# EAGLE design Noduino-Falcon (EAGLE 6.6.0)
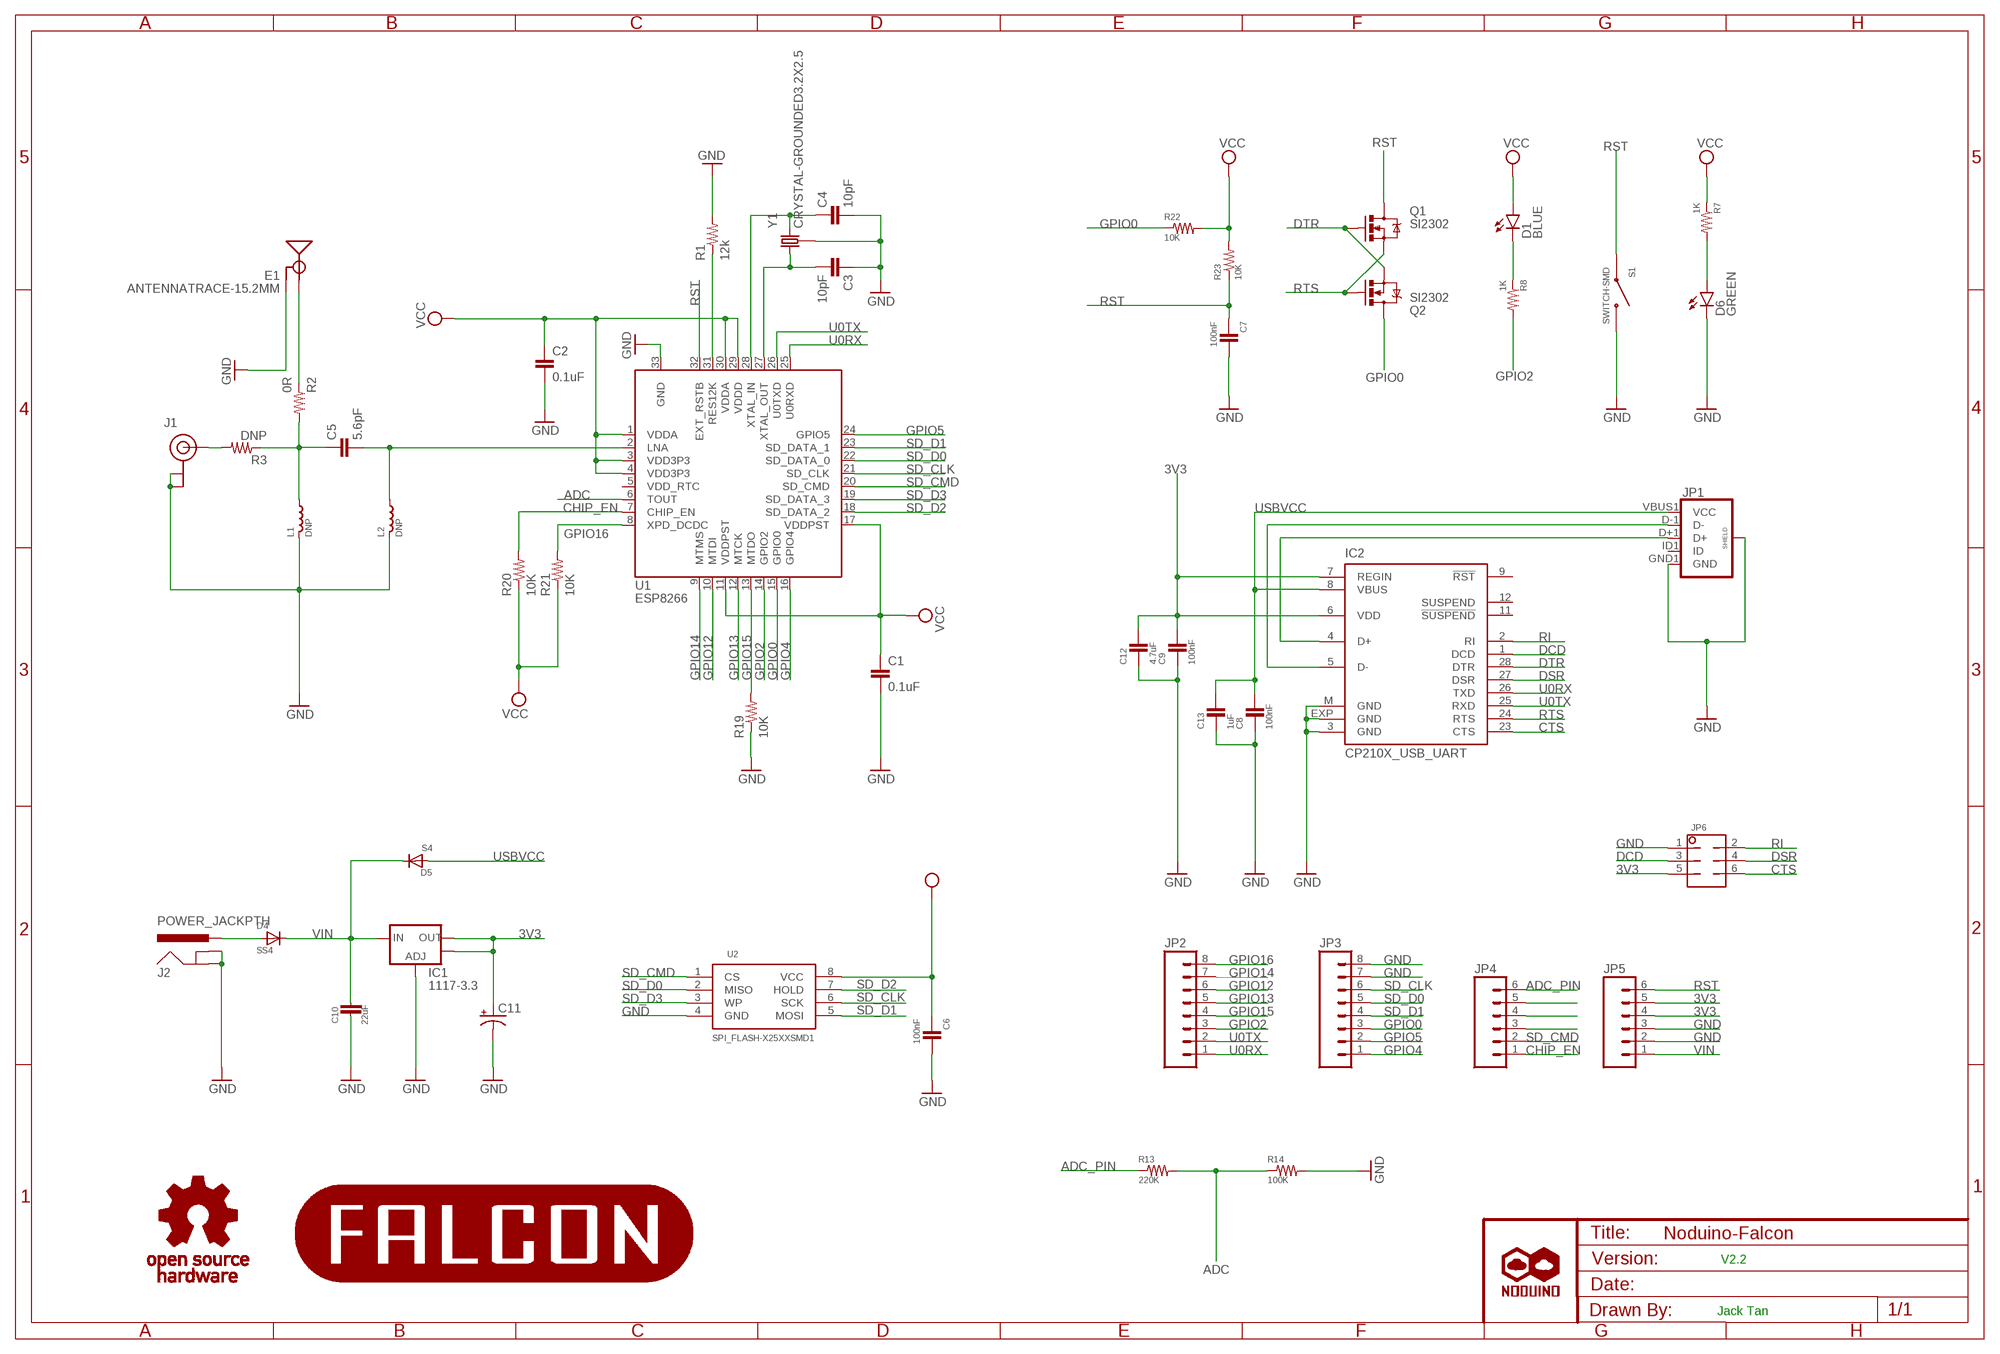
[diagram p0: schematic, sheet 1]

## Parts
C1  0.1uF  0603-CAP  [0603-CAP]
C2  0.1uF  0603-CAP  [0603-CAP]
C3  10pF  0603-CAP  [0603-CAP]
C4  10pF  0603-CAP  [0603-CAP]
C5  5.6pF  0603-CAP  [0603-CAP]
C6  100nF  0603-CAP  [0603-CAP]
C7  100nF  0603-CAP  [0603-CAP]
C8  100nF  0603-CAP  [0603-CAP]
C9  100nF  0603-CAP  [0603-CAP]
C10  22uF  CAP-C1206  [C1206]
C11  CAP_POL3528  [EIA3528]
C12  4.7uF  0603-CAP  [0603-CAP]
C13  1uF  0603-CAP  [0603-CAP]
D1  BLUE  LED-GREEN0603  [LED-0603]
D4  SS4  DIODESMB  [SMB-DIODE]
D5  S4  DIODESOD  [SOD-323]
D6  GREEN  LED-GREEN0603  [LED-0603]
E1  ANTENNATRACE-15.2MM  [TRACE_ANTENNA_2.4GHZ_15.2MM]
IC1  1117-3.3  AMS1117SOT223  [SOT223]
IC2  CP210X_USB_UART  [MLP28]
J1  U.FL  [U.FL]
J2  POWER_JACKPTH  [POWER_JACK_PTH]
JP1  USB_MICROB_PLUGCONN-11752  [USB-B-MICRO-SMD_V03]
JP2  M081X08  [1X08]
JP3  M081X08  [1X08]
JP4  M06SIP  [1X06]
JP5  M06SIP  [1X06]
JP6  M02X3  [2X3]
L1  DNP  INDUCTOR0402  [0402-IND]
L2  DNP  INDUCTOR0402  [0402-IND]
Q1  SI2302  -MOSFET-N-SMD  [SOT23-3]
Q2  SI2302  -MOSFET-N-SMD  [SOT23-3]
R1  12k  0603-RESISTOR  [0603-RES]
R2  0R  0603-RESISTOR  [0603-RES]
R3  DNP  0402-RESISTOR  [0402-RES]
R7  1K  0603-RESISTOR  [0603-RES]
R8  1K  0603-RESISTOR  [0603-RES]
R13  220K  0603-RESISTOR  [0603-RES]
R14  100K  0603-RESISTOR  [0603-RES]
R19  10K  0603-RESISTOR  [0603-RES]
R20  10K  0603-RESISTOR  [0603-RES]
R21  10K  0603-RESISTOR  [0603-RES]
R22  10K  0603-RESISTOR  [0603-RES]
R23  10K  0603-RESISTOR  [0603-RES]
S1  SWITCH-SMD  [TACTILE-SWITCH-1101NE]
U1  ESP8266  [QFN-32]
U2  SPI_FLASH-X25XXSMD1  [SO08-EIAJ]
U$1  NODUINO-LOGO-ALL  [NODUINO-ALL-1]
U$2  NODUINO-FALCON  [NODUINO-FALCON]
U$3  OPEN_HARDWARE_LOGO  [OPEN_HARDWARE_LOGO]
Y1  CRYSTAL-GROUNDED3.2X2.5  [CRYSTAL-SMD-3.2X2.5]

## Nets
3V3: C1.1 C2.1 C6.1 C9.2 C11.A(+) C12.2 D1.A IC1.2(OUT) IC1.4(OUT) IC2.6(VDD) IC2.7(REGIN) JP5.4 JP5.5 JP6.5 R7.1 R20.1 R21.1 R22.2 R23.2 U1.1(VDDA) U1.3(VDD3P3) U1.4(VDD3P3) U1.11(VDDPST) U1.17(VDDPST) U1.29(VDDD) U1.30(VDDA) U2.8(VCC) ; supply symbol labelled VCC
ADC: R13.2 R14.1 U1.6(TOUT)
ADC_PIN: JP4.6 R13.1
CHIP_EN: JP4.1 R20.2 U1.7(CHIP_EN)
CTS: IC2.23(CTS) JP6.6
DCD: IC2.1(DCD) JP6.3
DSR: IC2.27(DSR) JP6.4
DTR: IC2.28(DTR) Q1.1(G) Q2.2(S)
GND: C1.2 C2.2 C3.1 C4.2 C6.2 C7.2 C8.1 C9.1 C10.2 C11.C(-) C12.1 C13.1 D6.C E1.GND IC1.1(ADJ) IC2.3(GND) IC2.EXP(GND) IC2.M(GND) J1.P$1(GND) J1.P$2(GND) J2.GND J2.GNDBREAK JP1.GND1(GND) JP1.SHIELD1(SHIELD) JP1.SHIELD2(SHIELD) JP1.SHIELD3(SHIELD) JP3.7 JP3.8 JP5.2 JP5.3 JP6.1 L1.1(X1) L2.1(X1) R1.2 R14.2 R19.1 S1.P$1 U1.33(GND) U2.4(GND) Y1.2(GND) Y1.4(GND)
GPIO0: JP3.3 Q2.3(D) R22.1 U1.15(GPIO0)
GPIO2: JP2.3 R8.2 U1.14(GPIO2)
GPIO4: JP3.1 U1.16(GPIO4)
GPIO5: JP3.2 U1.24(GPIO5)
GPIO12: JP2.6 U1.10(MTDI)
GPIO13: JP2.5 U1.12(MTCK)
GPIO14: JP2.7 U1.9(MTMS)
GPIO15: JP2.4 R19.2 U1.13(MTDO)
GPIO16: JP2.8 R21.2 U1.8(XPD_DCDC)
LNA: C5.2 L2.2(X2) U1.2(LNA)
N$1: D1.C R8.1
N$2: C4.1 U1.28(XTAL_IN) Y1.3
N$3: C3.2 U1.27(XTAL_OUT) Y1.1
N$5: IC2.4(D+) JP1.D+1(D+)
N$7: E1.ANT(SIGNAL) R2.1
N$9: IC2.5(D-) JP1.D-1(D-)
N$12: JP4.5
N$13: D6.A R7.2
N$14: JP4.4
N$15: JP4.3
N$16: D4.A J2.PWR
N$17: R1.1 U1.31(RES12K)
N$18: J1.P$3(SIGNAL) R3.2
N$20: C5.1 L1.2(X2) R2.2 R3.1
RI: IC2.2(RI) JP6.2
RST: C7.1 JP5.6 Q1.3(D) R23.1 S1.P$2 U1.32(EXT_RSTB)
RTS: IC2.24(RTS) Q1.2(S) Q2.1(G)
SD_CLK: JP3.6 U1.21(SD_CLK) U2.6(SCK)
SD_CMD: JP4.2 U1.20(SD_CMD) U2.1(CS)
SD_D0: JP3.5 U1.22(SD_DATA_0) U2.2(MISO)
SD_D1: JP3.4 U1.23(SD_DATA_1) U2.5(MOSI)
SD_D2: U1.18(SD_DATA_2) U2.7(HOLD)
SD_D3: U1.19(SD_DATA_3) U2.3(WP)
U0RX: IC2.26(TXD) JP2.1 U1.25(U0RXD)
U0TX: IC2.25(RXD) JP2.2 U1.26(U0TXD)
USBVCC: C8.2 C13.2 D5.2(A) IC2.8(VBUS) JP1.VBUS1(VCC)
VIN: C10.1 D4.C D5.1(C) IC1.3(IN) JP5.1
Unconnected: IC2.9(!RST) IC2.11(!SUSPEND) IC2.12(SUSPEND) JP1.ID1(ID) U1.5(VDD_RTC)

## Notes on the sheet
- V2.2
- Jack Tan

## Library data of the parts
C1-C9 C12 C13 = ehl:0603-CAP
C10 = digital-toy:CAP: Capacitor Standard 0603 ceramic capacitor, and 0.1" leaded capacitor.
C11 = ehl:CAP_POL: Capacitor Polarized These are standard SMD and PTH capacitors. Normally 10uF, 47uF, and 100uF in electrolytic and tantalum varieties. Always verify the external diameter of the through hole cap, it varies with capacity, voltage, and manufacturer. The EIA devices should be standard.
D1 = SparkFun_ESP8266_Thing:LED-GREEN: Various green LEDs Green LEDs used in SFE Production 0603- DIO-00821 LARGE- DIO-00862 LILYPAD- DIO-09910; PROD_ID: DIO-00821; VALUE: GREEN
D4 D5 = ehl:DIODE: Diode These are standard reverse protection diodes and small signal diodes. SMA package can handle up to about 1A. SOD-323 can handle about 200mA. What the SOD-323 package when ordering, there are some mfgs out there that are 5-pin packages.
D6 = SparkFun_ESP8266_Thing:LED-GREEN: Various green LEDs Green LEDs used in SFE Production 0603- DIO-00821 LARGE- DIO-00862 LILYPAD- DIO-09910; PROD_ID: DIO-00821
E1 = SparkFun_ESP8266_Thing:ANTENNA: Chip antenna Chip antenna with ground or secondary connection. Common with larger metal RF connectors.
IC1 = ehl:AMS1117: Voltage Regulator LM1117 Standard adjustable voltage regulator but in SMD form. Spark Fun Electronics SKU : COM-00595
IC2 = ehl:CP210X_USB_UART: Single-Chip USB to UART Bridge Source: www.silabs.com .. CP2101.pdf / cp2102.pdf. Spark Fun Electronics SKU : COM-00310
J1 = SparkFun_ESP8266_Thing:U.FL: SMD antenna connector- WRL-09144; PROD_ID: CONN-09193
J2 = ehl:POWER_JACK: Power Jack This is the standard 5.5mm barrel jack for power. The PTH is the most common, proven, reliable, footprint. All others are experimental. The Slot footprint only works if the mill layer is transmitted to the PCB fab house so be warned. Spark Fun Electronics SKU : PRT-00119. Mating wall wart : TOL-00298 (and others)
JP1 = ehl:USB_MICROB_PLUG: USB Micro-B connectors Some male, some female. Watch your step!; PROD_ID: CONN-11752
JP2 JP3 = ehl:M08: Header 8 Standard 8-pin 0.1" header. Use with straight break away headers (SKU : PRT-00116), right angle break away headers (PRT-00553), swiss pins (PRT-00743), machine pins (PRT-00117), and female headers (PRT-00115).
JP4 JP5 = ehl:M06: Header 6 Standard 6-pin 0.1" header. Use with straight break away headers (SKU : PRT-00116), right angle break away headers (PRT-00553), swiss pins (PRT-00743), machine pins (PRT-00117), and female headers (PRT-00115). Molex polarized connector foot print use with SKU : PRT-08094 with associated crimp pins and housings. NOTES ON THE VARIANTS LOCK and LOCK_LONGPADS... This footprint was designed to help hold the alignment of a through-hole component (i.e. 6-pin header) while soldering it into place. You may notice that each hole has been shifted either up or down by 0.005 of an inch from it's more standard position (which is a perfectly straight line). This slight alteration caused the pins (the squares in the middle) to touch the edges of the holes. Because they are alternating, it causes a "brace" to hold the component in place. 0.005 has proven to be the perfect amount of "off-center" position when using our standard breakaway headers. Although looks a little odd when you look at the bare footprint, once you have a header in there, the alteration is very hard to notice. Also, if you push a header all the way into place, it is covered up entirely on the bottom side. This idea of altering the position of holes to aid alignment will be further integrated into the Sparkfun Library for other footprints. It can help hold any component with 3 or more connection pins.
JP6 = ehl:M02X3
L1 L2 = ehl:INDUCTOR
Q1 Q2 = digital-toy:*-MOSFET-N
R1 R2 R7 R8 R13 R14 R19-R23 = ehl:0603-RESISTOR
R3 = ehl:0402-RESISTOR
S1 = ehl:SWITCH-SMD
U1 = ehl:ESP8266
U2 = ehl:SPI_FLASH-X25XX: 8pin SPI Flash series x25xx. Works with devices like W25X32 and BR25L32
U$1 = ehl:NODUINO-LOGO-ALL
U$2 = ehl:NODUINO-FALCON
U$3 = ehl:OPEN_HARDWARE_LOGO
Y1 = SparkFun_ESP8266_Thing:CRYSTAL-GROUNDED

## Board
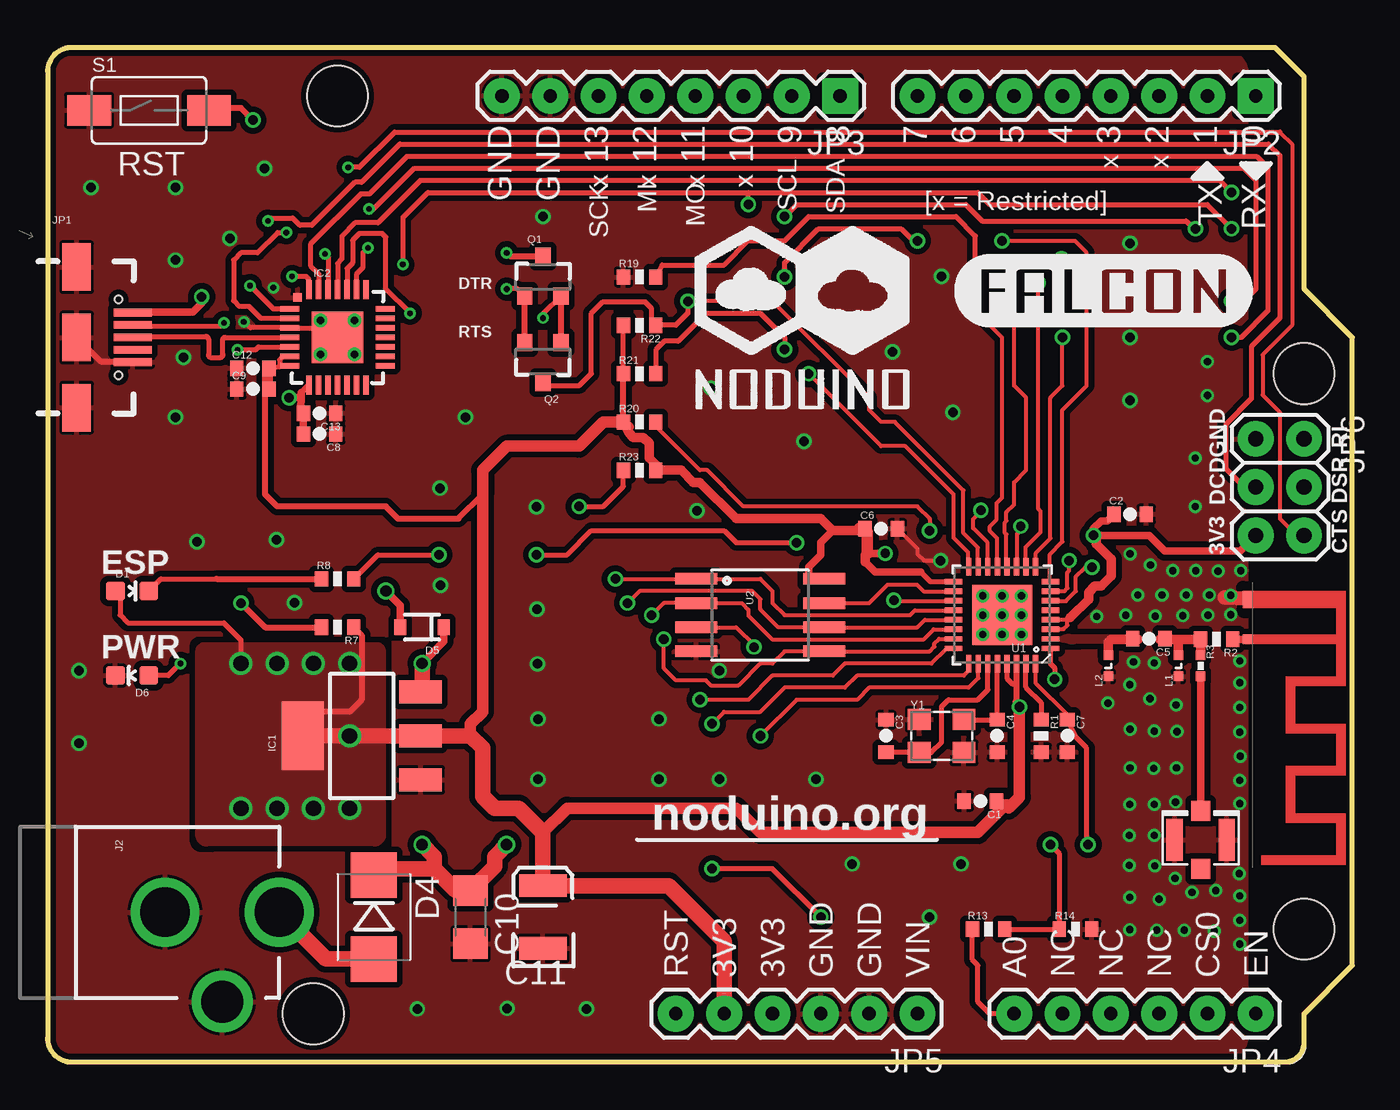
[diagram p1: board, top side]
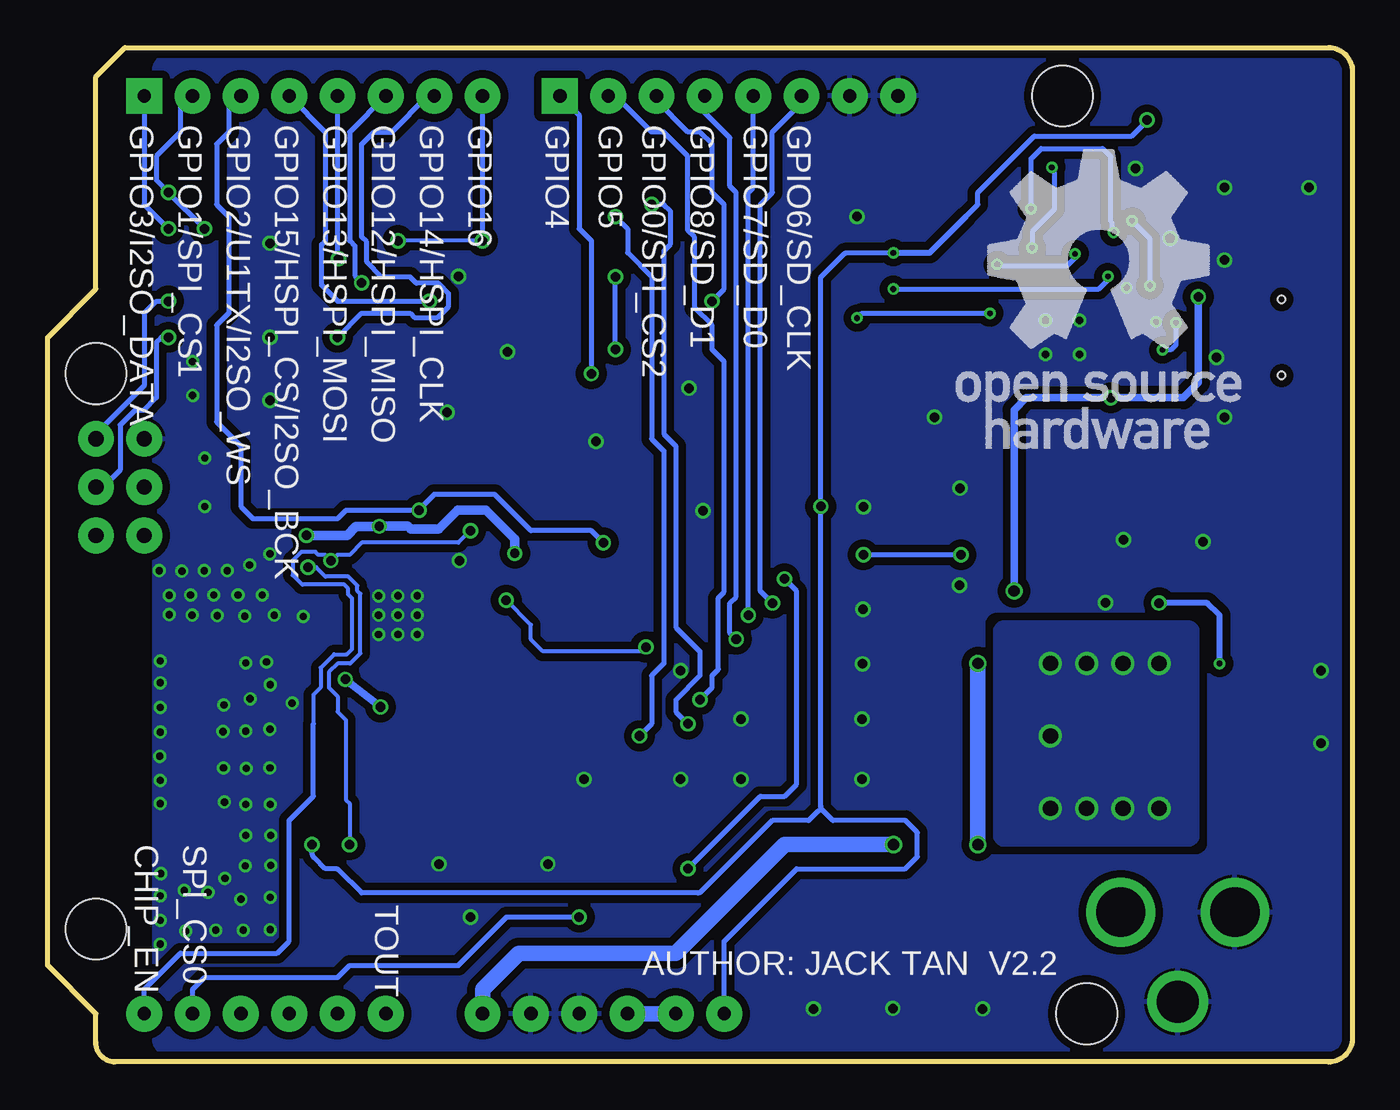
[diagram p2: board, bottom side, seen from below]

Size 68.58 x 53.34 mm. Coordinates in mm from the lower left corner, seen from the top.
Outline: 1.27,0 65.02,0 arc90 66.04,1.02 66.04,2.54 68.58,5.08 68.58,38.1 66.04,40.64 66.04,51.82 64.52,53.34 1.27,53.34 arc90 0,52.07 0,1.27 arc90 1.27,0
Copper layers (1*16): Top 0.035mm / dielectric 1.5mm / Bottom 0.035mm
Design rules "jackslab-micromod": minimum track width 6mil, minimum drill 0.3mm, track to track 6mil, track to pad 6mil, pad to pad 6mil, via to via 6mil, smd to smd 6mil, copper to edge 6mil, drill to drill 6mil, minimum pad ring 6mil, minimum via ring 6mil, stop-mask expansion 4mil, vias tented up to drill 20mil, thermal gap 6mil
Holes 3.2 mm at 66.04,6.99 66.04,36.2 15.24,50.8 13.97,2.54

### Footprints (pad centres in the part's own frame; a part is rotated, then mirrored left to right if it is on the bottom)
0603-CAP = smd 0.7 x 0.8: 1 -0.85,0; 2 0.85,0
C1206 = smd 1.6 x 1.8: 1 -1.4,0; 2 1.4,0
EIA3528 = smd 1.2 x 2.5: A 1.65,0; C -1.65,0
LED-0603 = smd 1 x 1: A 0,-0.877; C 0,0.877
SMB-DIODE = smd 2.4 x 2.4: A 2.2,0; C -2.2,0
SOD-323 = smd 0.63 x 0.83: 1 -1.15,0; 2 1.15,0
TRACE_ANTENNA_2.4GHZ_15.2MM = smd 0.5 x 0.5: ANT 0,-0.25 | smd 0.9 x 0.5: GND -2.1,-0.25
SOT223 = smd 1.219 x 2.235: 1 -2.311,-3.099; 2 0,-3.099; 3 2.311,-3.099 | smd 3.6 x 2.2: 4 0,3.099
MLP28 = smd 1 x 0.3: 1 -2.5,1.5; 2 -2.5,1; 3 -2.5,0.5; 4 -2.5,0; 5 -2.5,-0.5; 6 -2.5,-1; 7 -2.5,-1.5; 15 2.5,-1.5; 16 2.5,-1; 17 2.5,-0.5; 18 2.5,0; 19 2.5,0.5; 20 2.5,1; 21 2.5,1.5 | smd 0.3 x 1: 8 -1.5,-2.5; 9 -1,-2.5; 10 -0.5,-2.5; 11 0,-2.5; 12 0.5,-2.5; 13 1,-2.5; 14 1.5,-2.5; 22 1.5,2.5; 23 1,2.5; 24 0.5,2.5; 25 0,2.5; 26 -0.5,2.5; 27 -1,2.5; 28 -1.5,2.5 | smd 2.7 x 2.7: EXP 0,0 | smd 0.435 x 0.435: M -2.103,2.103
U.FL = smd 2.2 x 0.85: P$1 0,1.375; P$2 0,-1.375 | smd 1.05 x 1: P$3 1.525,0; P$4 -1.525,0
POWER_JACK_PTH = drill 2.6: GND 0,7.7; PWR 0,13.7 | drill 2.2: GNDBREAK 4.7,10.7
USB-B-MICRO-SMD_V03 = smd 2 x 0.4: D+1 2.954,0; D-1 2.954,0.65; GND1 2.954,-1.3; ID1 2.954,-0.65; VBUS1 2.954,1.3 | smd 1.5 x 2.5: SHIELD1 0,3.7; SHIELD2 0,-3.7; SHIELD3 0,0 | hole 0.4: 2.2,2; 2.2,-2
1X08 = drill 0.7 pad 1.88 square: 1 0,0 | drill 0.7 pad 1.88: 2 2.54,0; 3 5.08,0; 4 7.62,0; 5 10.16,0; 6 12.7,0; 7 15.24,0; 8 17.78,0
1X06 = drill 0.7 pad 1.88: 1 0,0; 2 2.54,0; 3 5.08,0; 4 7.62,0; 5 10.16,0; 6 12.7,0
2X3 = drill 0.8 pad 1.88: 1 0,0; 2 0,2.54; 3 2.54,0; 4 2.54,2.54; 5 5.08,0; 6 5.08,2.54
0402-IND = smd 0.5 x 0.5: 1 -0.55,0; 2 0.55,0
SOT23-3 = smd 0.8 x 0.9: 1 -0.95,-1; 2 0.95,-1; 3 0,1.1
0603-RES = smd 0.7 x 0.8: 1 -0.85,0; 2 0.85,0
0402-RES = smd 0.5 x 0.5: 1 -0.55,0; 2 0.55,0
TACTILE-SWITCH-1101NE = smd 2.3 x 1.6: P$1 -3.15,0; P$2 3.15,0
QFN-32 = smd 0.916 x 0.285: 1 -2.552,1.75; 2 -2.552,1.25; 3 -2.552,0.75; 4 -2.552,0.25; 5 -2.552,-0.25; 6 -2.552,-0.75; 7 -2.552,-1.25; 8 -2.552,-1.75; 17 2.552,-1.75; 18 2.552,-1.25; 19 2.552,-0.75; 20 2.552,-0.25; 21 2.552,0.25; 22 2.552,0.75; 23 2.552,1.25; 24 2.552,1.75 | smd 0.285 x 0.916: 9 -1.75,-2.552; 10 -1.25,-2.552; 11 -0.75,-2.552; 12 -0.25,-2.552; 13 0.25,-2.552; 14 0.75,-2.552; 15 1.25,-2.552; 16 1.75,-2.552; 25 1.75,2.552; 26 1.25,2.552; 27 0.75,2.552; 28 0.25,2.552; 29 -0.25,2.552; 30 -0.75,2.552; 31 -1.25,2.552; 32 -1.75,2.552 | smd 3.15 x 3.15: 33 0,0
SO08-EIAJ = smd 0.61 x 2.21: 1 -1.905,-3.378; 2 -0.635,-3.378; 3 0.635,-3.378; 4 1.905,-3.378; 5 1.905,3.353; 6 0.635,3.353; 7 -0.635,3.353; 8 -1.905,3.353
CRYSTAL-SMD-3.2X2.5 = smd 1.2 x 1.1: 1 -1.175,-0.875; 2 1.175,-0.875; 3 1.175,0.875; 4 -1.175,0.875

### Placement (x,y rotation side)
C1  49.02,13.72 180 top
C2  56.9,28.8 0 top
C3  44.07,17.14 270 top
C4  49.91,17.14 270 top
C5  57.89,22.25 180 top
C6  43.81,28.04 0 top
C7  53.59,17.14 270 top
C8  14.3,33.02 180 top
C9  10.79,35.38 0 top
C10  22.23,7.62 270 top
C11  26.04,7.62 90 top
C12  10.79,36.47 0 top
C13  14.3,34.11 180 top
D1  4.45,24.77 270 top
D4  17.14,7.62 270 top
D5  19.68,22.86 180 top
D6  4.45,20.32 90 top
E1  63.32,22.23 270 top
IC1  16.51,17.14 90 top
IC2  15.24,38.1 0 top
J1  60.6,11.68 90 top
J2  -1.52,7.87 270 top
JP1  1.52,38.1 0 top
JP2  63.5,50.8 180 top
JP3  41.66,50.8 180 top
JP4  63.5,2.54 180 top
JP5  45.72,2.54 180 top
JP6  63.5,32.77 270 top
L1  59.44,20.83 90 top
L2  55.75,20.83 90 top
Q1  26.04,41.27 0 top
Q2  26.04,36.83 180 top
R1  52.22,17.14 270 top
R2  61.44,22.23 180 top
R3  60.6,20.83 270 top
R7  15.24,22.86 180 top
R8  15.24,25.4 0 top
R13  49.45,6.99 0 top
R14  54.03,6.99 0 top
R19  31.11,41.27 0 top
R20  31.11,33.66 0 top
R21  31.11,36.2 0 top
R22  31.11,38.73 180 top
R23  31.11,31.11 0 top
S1  5.33,50.04 0 top
U1  50.16,23.5 180 top
U2  37.47,23.5 270 top
U$1  33.66,33.66 0 top
U$2  47.68,38.64 0 top
U$3  20.82,32.24 0 bottom
Y1  46.99,17.14 0 top

### Tracks (layer width: path | path; a pad name or v marks a point on that pad's centre or on a via)
3V3  (via drill 0.48, 0.5, 0.81)
  Top 0.152: 52.93,23.24 52.96,23.27 | 53.7,23.44 53.75,23.37 | 52.65,22.73 52.68,22.76 | 55.22,27.69 55.12,27.69
  Top 0.203: 52.63,22.76 52.65,22.73 | 50.93,25.96 50.95,25.98 50.95,27.76 51.16,27.96 v51.16,28.17 | v44.02,26.75 43.89,26.67 43.81,26.67 | 42.97,26.67 43.09,26.75 | 52.96,23.27 53.52,23.27 53.59,23.34 | 53.59,23.34 53.7,23.44 | 52.68,22.76 53.39,22.76 53.59,22.96 53.59,23.34 | C1.1 50.86,13.72 50.51,13.35
  Top 0.254: U1.3 52.63,22.76 | U1.4 52.62,23.24 52.93,23.24 53.01,23.24 | R21.1 R22.2 | R20.1 30.48,33.44 | U1.17 47.71,25.25 46.41,25.25 45.9,25.76 | U1.11 50.93,25.96 | U1.1 52.7,21.66 52.7,20.95 52.93,20.73 v52.93,20.12 | 42.55,27.94 42.65,28.04 | U1.29 50.42,20.87 50.42,20.17 50.7,19.89 50.91,19.89 | 16.51,22.44 R7.1 | 12.19,36.6 IC2.7 | IC2.6 12.37,37.11 12.19,36.93 12.19,36.6 | D1.A 3.81,24.52 3.81,23.5 4.22,23.09 9.27,23.09 10.16,22.2 v10.16,20.95 | C9.2 11.43,35.48 11.43,36.2 | C12.2 12.19,36.58 12.19,36.6
  Top 0.305: IC1.4 13.41,17.22 13.97,17.78 13.34,17.78 13.34,18.41 15.88,18.41 16.51,19.05 16.51,22.44 | 30.48,36.2 R21.1 R20.1 | U2.8 40.01,25.48 | v54.97,27.69 54.91,27.74 | U1.30 50.91,19.89 50.91,18.93 | 22.86,29.84 21.59,28.57 18.41,28.57 17.78,29.21 12.06,29.21 11.43,29.84 11.43,36.2
  Top 0.406: 40.01,25.48 40.01,26.04 40.64,26.67 40.64,27.3 41.27,27.94 | 45.9,25.76 43.51,25.76 42.97,26.3 | JP6.5 62.69,26.87 58.73,26.87 57.91,27.69 55.12,27.69 v54.97,27.69 54.97,28.04 55.37,28.45 55.69,28.45 C2.1 | 43.09,26.75 v44.02,26.75 | v51.08,18.67 50.91,18.93 | C6.1 43.09,27.87 | C9.2 C12.2
  Top 0.508: 42.97,26.3 42.97,26.67 | 42.55,27.94 41.27,27.94 40.64,28.57 36.2,28.57 34.29,30.48 33.93,30.48 33.3,31.11 32.26,31.11 32.02,31.36 | 55.12,27.69 55.12,27.23 55.91,26.44 55.91,25.55 55.37,25.02 55.04,25.02 54.71,24.69 54.71,24.31 53.75,23.37 | 32.02,31.36 31.62,31.75 31.62,32.54 31.32,32.84 30.79,32.84 30.57,33.06 R20.1 30.57,33.39 | R23.2 31.91,31.36 32.02,31.36
  Top 0.61: 26.04,12.06 27.3,13.34 36.2,13.34 37.47,12.06 48.9,12.06 50.29,13.46 50.51,13.35 51.08,13.92 v51.08,18.67 | R20.1 29.21,33.66 27.94,32.38 24.13,32.38 22.86,31.11 22.86,29.84 22.86,18.41 22.23,17.78 22.23,17.14 | 42.65,28.04 C6.1 | 43.09,27.87 43.09,26.75
  Top 0.813: JP5.5 35.56,6.35 32.64,9.27 C11.A 26.04,12.06 24.77,13.34 23.5,13.34 22.86,13.97 22.86,16.51 22.23,17.14 IC1.2 IC1.4
  Bottom 0.203: v51.16,28.17 51.18,28.14
  Bottom 0.254: 52.91,20.09 v52.93,20.12
  Bottom 0.406: v51.08,18.67 52.91,20.09 | v51.16,28.17 50.98,28.19
  Bottom 0.508: 50.98,28.19 49.66,28.19 49.48,28.02 48.03,28.02 47.02,29.03 45.54,29.03 44.02,27.51 v44.02,26.75 | 51.18,28.14 52.38,28.14 52.83,27.69 v54.97,27.69
  Bottom 0.813: JP5.5 JP5.4
  other vias: 12.06,20.95 13.97,20.95 15.88,20.95 10.16,13.34 12.06,13.34 13.97,13.34 15.88,13.34 15.88,17.14
  pour Bottom (no thermals): 8.13,12.7 8.13,22.61 arc-90 8.64,23.11 17.53,23.11 18.03,23.11 18.29,23.11 arc-90 18.8,22.61 18.8,18.29 18.8,12.19 18.8,11.94 arc-90 18.29,11.43 8.64,11.43 arc-90 8.13,11.94
  pour Top (no thermals): 7.87,12.7 7.87,21.59 arc-90 8.26,21.97 17.14,21.97 17.3,21.97 arc-90 17.68,21.59 17.68,18.82 17.68,15.39 17.68,14.43 17.68,12.83 17.68,11.96 arc-90 17.14,11.43 8.38,11.43 arc-90 7.87,11.94
ADC  (via drill 0.5)
  Top 0.203: 52.65,24.23 arc-45 U1.6 52.63,24.26 52.65,24.23 53.52,24.23 54.05,24.77 54.05,25.53 54.53,26.01 v54.89,26.01 54.86,25.98 | v52.7,11.43 52.87,11.26
  Top 0.254: R13.2 R14.1 53.17,10.96 52.87,11.26
  Bottom 0.203: v52.7,11.43 52.7,13.59 52.91,13.79 52.91,17.98 53.34,18.41 53.34,19.23 53.8,19.68 53.8,20.5 53.34,20.95 52.68,20.95 52.15,21.49 52.15,24.61 52.3,24.77 52.3,25.04 52.78,25.53 53.98,25.53 54.46,26.01 v54.89,26.01 54.71,26.01
ADC_PIN
  Top 0.254: JP4.6 49.53,2.54 48.9,3.17 48.9,5.08 48.6,5.38 R13.1
CHIP_EN  (via drill 0.5)
  Top 0.203: v46.35,27.94 46.35,28.57 45.72,29.21 36.58,29.21 34.67,31.11 34.29,31.11 31.75,33.66 R20.2 | 52.63,24.77 U1.7 53.42,24.75 53.59,24.92 53.59,25.73 53.7,25.83 v53.7,26.36
  Bottom 0.203: v46.35,27.94 46.99,27.3 52.07,27.3 52.7,26.67 53.34,26.67 53.65,26.36 v53.7,26.36 54,26.67 54.36,26.67 54.51,26.82 55.24,26.82 55.7,26.36 55.7,25.6 55.19,25.09 52.98,25.09 52.78,24.89 52.78,24.59 52.58,24.38 52.58,21.72 52.86,21.44 53.52,21.44 54.23,20.73 54.23,19.68 54.61,19.3 54.61,17.78
  Bottom 0.254: JP4.1 63.5,3.81 61.59,5.71 56.52,5.71 55.88,6.35 55.88,12.7 54.61,13.97 54.61,17.78
CTS  (via drill 0.3)
  Top 0.203: 64.77,48.9 65.41,48.26 65.41,38.73 63.86,37.19 63.86,35.08 64.77,34.16 64.77,28.57 65.66,27.69
  Top 0.254: 64.77,48.9 18.24,48.9 16.38,47.04 v15.8,47.04 | 65.66,27.69 JP6.6 | IC2.23 16.26,40.62 16.26,41.45 16.59,41.78 16.59,42.57 16.82,42.8 v16.84,42.8
  Bottom 0.254: v16.84,42.8 16.79,42.85 16.79,43.69 15.67,44.81 15.67,46.79 v15.8,47.04
DCD  (via drill 0.3)
  Top 0.254: JP6.3 62.89,30.23 61.92,31.19 61.92,33.53 63.27,34.87 63.27,37.62 64.77,39.12 64.77,47.68 64.16,48.26 18.52,48.26 16.51,46.25 16.15,46.25 13.89,43.99 13.26,43.99 12.88,44.37 11.71,44.37 11.58,44.25 v11.58,44.22 | v10.64,40.82 11.86,39.6 IC2.1
  Bottom 0.254: v11.58,44.22 10.64,43.28 v10.64,40.82
DSR  (via drill 0.5)
  Top 0.254: v62.23,38.1 62.74,38.1 64.14,39.5 64.14,47.04 63.55,47.62 18.9,47.62 16.92,45.64 16.46,45.64 13.82,43 13.82,41.88 14.24,41.46 IC2.27
  Bottom 0.254: JP6.4 65.66,30.23 64.77,31.11 64.77,33.5 63.98,34.29 63.5,34.29 62.87,34.92 62.87,37.85 62.61,38.1 v62.23,38.1
DTR  (via drill 0.3)
  Top 0.254: Q1.1 25.07,40.26 24.66,40.66 24.16,40.66 v24.13,40.64 | IC2.28 13.72,40.62 13.72,41.17 13.59,41.3 v12.85,41.3
  Top 0.305: Q2.2 Q1.1
  Bottom 0.254: v24.13,40.64 13.34,40.64 12.85,41.12 v12.85,41.3
GND  (via drill 0.3, 0.38, 0.4, 0.5)
  Top 0.203: C6.2 45.72,26.99 45.72,26.72 46.08,26.36 v46.94,26.36
  Top 0.254: 14.25,38.58 12.76,38.58 IC2.3 10.67,38.61 v10.31,38.91
  Top 0.305: JP1.SHIELD3 2.79,36.83 3.81,36.83 3.84,36.8 JP1.GND1 | E1.GND 63.09,24.36 | 14.25,38.58 14.73,38.1 IC2.EXP
  Top 0.61: 61.87,24.43 v62.18,24.54
  Top 0.762: 63.09,24.36 61.87,24.43
  other vias: 35.31,20.57 56.9,43.05 56.9,38.1 56.9,34.8 26.04,44.45 62.71,25.83 62.66,21.08 62.66,19.94 62.66,18.64 62.66,17.35 62.69,16.08 62.64,9.91 62.66,8.74 61.39,9.02 60.15,8.92 56.87,8.66 56.85,10.34 56.87,13.54 58.14,15.44 55.73,18.87 59.36,17.37 62.18,23.52 60.35,25.83 59.13,25.83 61.52,25.81 60.33,29.21 60.33,31.75 60.96,35.05 60.96,36.83 44.4,37.34 47.57,34.16 46.99,41.3 6.73,42.16 6.73,33.91 7.14,37.06 11.4,46.99 21.97,33.91 25.73,23.8 25.76,20.93 28.32,2.79 1.65,20.57 1.65,16.76 12.04,27.46 7.85,27.36 12.98,24.16 20.65,25.07 20.62,30.18 32.13,18.03 25.78,18.03 25.78,14.86 32.13,14.86 35.31,14.86 40.39,14.86 42.29,10.41 48.01,10.41 39.75,32.64 19.43,2.79 59.33,15.47 58.17,17.4 56.9,15.47 58.17,13.54 56.85,11.91 58.17,11.91 58.19,10.31 56.87,6.96 58.29,6.93 61.32,6.88 62.66,7.44 57.96,26.14 56.9,26.72 62.66,14.81 62.66,13.59 62.66,6.2 61.06,24.56 60.99,23.5 59.84,24.56 59.66,23.47 57.3,24.56 58.57,24.56 56.67,23.5 58.22,23.44 57.07,21.03 58.17,20.98 59.31,18.77 59.28,13.67 56.87,19.84 57.94,19.1 55.14,23.42 59.74,6.93 59.26,9.65 58.42,8.56 9.58,43.31 2.29,45.97 6.73,45.97 24.16,2.82 25.7,29.18 34.87,35.43 46.35,7.62 34.14,28.98 50.16,23.5 50.16,24.51 49.15,24.51 49.15,23.5 49.15,22.48 50.16,22.48 51.18,22.48 51.18,23.5 51.18,24.51 56.9,17.5 11.86,40.72 14.35,37.21 16.13,37.21 16.13,38.99 14.35,38.99
  pour Top (isolate 0.406, rank 2): 0.25,51.82 0.25,52.07 arc-90 1.27,53.09 61.98,53.09 arc-90 62.99,52.07 62.99,1.27 arc-90 61.98,0.25 1.27,0.25 arc-90 0.25,1.27
  pour Top (isolate 0.305, rank 2): 0.25,44.7 0.25,52.07 arc-90 1.27,53.09 61.98,53.09 arc-90 62.99,52.07 62.99,1.27 arc-90 61.98,0.25 1.27,0.25 arc-90 0.25,1.27
  pour Bottom (isolate 0.406, rank 2): 61.98,53.09 arc-90 62.99,52.07 62.99,49.28 62.99,1.27 arc-90 61.98,0.25 61.47,0.25 0,0.25 arc-90 -1.02,1.27 -1.02,15.49 -1.02,46.99 -1.02,52.58 arc-90 -0.25,53.09
GPIO0  (via drill 0.5)
  Top 0.203: U1.15 48.9,25.96 48.9,27.05 48.13,27.81 48.13,30.05 44.53,33.66 43.81,33.66 43.18,34.29 43.18,34.92 38.1,40.01 v33.66,40.01
  Top 0.254: Q2.3 26.2,35.56 27.94,35.56 28.57,36.2 28.57,39.37 29.18,39.98 31.39,39.98 31.75,39.62 31.75,38.82 R22.1 33.02,38.73 33.66,39.37 v33.66,40.01
  Bottom 0.254: v33.66,40.01 33.02,40.64 33.02,45.09 33.66,45.72 33.66,48.26 34.29,48.9 34.92,48.9 36.58,50.55 JP3.3
GPIO2  (via drill 0.5)
  Top 0.203: U1.14 49.4,25.96 49.4,27.3 48.64,28.07 48.64,28.55 49.05,28.96 v49.05,29.01
  Top 0.254: R8.2 17.36,26.67 v20.57,26.67 | v39.37,27.3 36.2,27.3 35.56,27.94 28.57,27.94 27.3,26.67 v25.7,26.67
  Bottom 0.254: v39.37,27.3 40.01,27.94 43.18,27.94 45.09,29.84 48.26,29.84 49.02,29.08 v49.05,29.01 52.91,29.01 53.34,28.57 57.78,28.57 58.42,29.21 58.42,32.38 59.69,33.66 59.69,38.73 59.05,39.37 59.05,44.45 59.69,45.09 59.69,48.26 59.05,48.9 59.05,50.16 JP2.3 | v20.57,26.67 v25.7,26.67
GPIO4  (via drill 0.5)
  Top 0.203: U1.16 48.39,25.97 48.39,26.8 47.62,27.56 47.62,29.84 45.09,32.38 43.81,32.38 v40.01,36.2
  Bottom 0.254: JP3.1 40.64,49.78 40.64,43.81 40.01,43.18 v40.01,36.2
GPIO5  (via drill 0.5)
  Top 0.203: v34.29,19.05 36.83,19.05 38.1,20.32 41.27,20.32 41.91,20.95 46.46,20.95 47.25,21.75 U1.24
  Bottom 0.254: v34.29,19.05 33.66,19.68 33.66,20.32 33.33,20.65 33.33,24.41 33.02,24.71 33.02,36.83 33.66,37.47 33.66,38.73 34.57,39.65 34.57,43.36 34.92,43.71 34.92,47.62 36.2,48.9 36.83,48.9 38.73,50.8 JP3.2
GPIO12  (via drill 0.5)
  Top 0.203: U1.10 51.44,25.96 51.41,25.99 51.41,27.08 52.2,27.86 52.2,28.96 52.07,29.08 v52.07,40.97
  Bottom 0.254: JP2.6 52.7,48.9 52.7,43.18 52.43,42.9 52.43,41.35 52.07,41 v52.07,40.97
GPIO13  (via drill 0.5)
  Top 0.203: U1.12 50.42,25.95 50.39,25.97 50.39,27.74 50.32,27.81 50.32,28.37 50.39,28.45 50.39,28.91 50.8,29.31 50.8,30.48 51.44,31.11 51.44,34.92 50.8,35.56 50.8,41.91 51.13,42.24 v53.29,42.24
  Bottom 0.203: v53.29,42.24 53.34,42.29
  Bottom 0.254: 53.34,42.29 JP2.5
GPIO14  (via drill 0.5)
  Top 0.203: U1.9 51.94,25.97 51.94,26.77 52.7,27.53 52.7,34.92 53.34,35.56 v53.34,38.1
  Bottom 0.254: v53.34,38.1 52.07,39.37 49.53,39.37 49.3,39.14 48.08,39.14 47.5,39.73 47.5,40.41 48.03,40.95 49.2,40.95 49.53,41.27 51,41.27 51.82,42.09 51.82,43.13 52.07,43.38 52.07,48.26 51.44,48.9 50.49,48.9 48.59,50.8 JP2.7
GPIO15  (via drill 0.5)
  Top 0.203: U1.13 49.91,25.95 49.91,27.53 49.53,27.91 49.53,28.17 49.89,28.52 49.89,29.39 50.16,29.67 50.16,38.1 48.51,39.75 v48.51,40.01
  Top 0.254: v48.51,40.01 48.77,40.26 48.77,43.43 47.75,44.45 40.01,44.45 38.73,43.18 36.83,43.18 35.56,41.91 32.3,41.91 R19.2
  Bottom 0.254: v48.51,40.01 53.34,40.01 54.18,40.84 54.18,42.98 53.98,43.18 53.98,48.9 JP2.4
GPIO16  (via drill 0.5)
  Top 0.152: U1.8 52.68,25.25 52.68,25.36
  Top 0.203: v50.16,43.18 53.98,43.18 54.61,42.55 54.61,35.56 53.34,34.29 53.34,27.36 52.68,26.7 52.68,25.36 52.7,25.34
  Top 0.254: v38.73,37.47 38.73,38.1 37.47,39.37 34.61,39.37 33.13,37.9 32.41,37.9 31.97,37.46 R21.2 31.75,36.2 | v38.73,41.27 38.73,42.04 40.51,43.81 44.86,43.81 45.49,43.18 v45.72,43.18
  Bottom 0.203: v45.72,43.18 v50.16,43.18
  Bottom 0.254: v45.72,43.18 JP2.8 | v38.73,37.47 v38.73,41.27
LNA
  Top 0.508: C5.2 57.31,22.23 55.88,22.23 55.75,22.1 L2.2
  pour Top (no thermals): 52.97,22.36 53.06,22.36 arc37 53.29,22.4 arc-38 53.74,22.5 57.09,22.49 arc-183 57.09,22 54.2,22 arc-29 53.14,22.12 arc47 52.98,22.15 arc-202
N$1
  Top 0.254: D1.C 5.96,25.4 8.89,25.4
  Top 0.305: 8.89,25.4 R8.1
N$2
  Top 0.254: Y1.3 48.44,17.97 48.46,18 C4.1 U1.28
N$3
  Top 0.254: C3.2 45.81,16.3 Y1.1 46.45,16.27 46.99,16.81 46.99,18.69 47.35,19.05 48.9,19.05 49.41,19.57 U1.27
N$4
  cutout Top: 13.34,40.01 17.14,40.01 17.14,36.2 13.34,36.2
N$5
  Top 0.203: JP1.D+1 4.58,38.2 4.61,38.18
  Top 0.254: 4.61,38.18 4.64,38.15 arc45 4.74,38.1 arc-90 4.79,38.15 8.31,38.15 arc-90 8.46,38 8.46,37.19 arc90 8.64,37.03 9.02,37.03 arc90 9.22,37.21 9.22,38 arc-90 9.35,38.1 IC2.4
N$6
  cutout Top: 48.13,25.53 52.2,25.53 52.2,21.46 48.13,21.46
N$7
  Top 0.406: E1.ANT R2.1
N$9  (via drill 0.3)
  Top 0.203: 4.24,38.73 4.34,38.68
  Top 0.254: 4.34,38.68 9.09,38.68 v9.27,38.86 | IC2.5 11.08,37.6 10.92,37.44 v9.98,37.44
  Top 0.305: JP1.D-1 4.24,38.73
  Bottom 0.254: v9.98,37.44 10.06,37.44 10.03,37.47 9.53,37.47 9.27,37.72 v9.27,38.86
N$13  (via drill 0.3, 0.5)
  Top 0.254: v6.99,20.95 6.35,20.32 D6.A
  Top 0.305: v10.16,24.13 11.43,22.86 R7.2
  Bottom 0.305: v6.99,20.95 6.99,23.5 7.62,24.13 v10.16,24.13
N$16
  Top 0.813: J2.PWR 14.63,5.42 D4.A
N$17
  Top 0.254: U1.31 51.41,19.7 52.22,18.9 R1.1
N$18
  Top 0.406: R3.2 J1.P$3
N$20
  Top 0.508: C5.1 58.46,22.23 59.44,22.23 | 59.44,22.23 R2.2 60.6,21.94 R3.1 | L1.2 59.44,22.23
RI  (via drill 0.3, 0.5)
  Top 0.254: v62.23,40.01 62.87,40.01 63.5,40.64 63.5,46.35 62.87,46.99 19.28,46.99 17.14,44.86 v16.89,44.86 | IC2.2 11.23,39.09 10.59,39.73 10.08,39.73 9.78,40.03 9.78,42.16 10.16,42.55 11.02,42.55 12.09,43.61 v12.55,43.61
  Bottom 0.254: JP6.2 66.04,33.02 63.5,35.56 63.5,39.37 62.87,40.01 v62.23,40.01 | v16.89,44.86 16.84,44.91 16.89,44.96 16.89,47.5 16.36,48.03 13.13,48.03 12.7,47.6 12.7,44.2 12.62,44.12 12.62,43.69 v12.55,43.61
RST  (via drill 0.3, 0.5)
  Top 0.203: U1.32 51.92,20.89 51.92,19.94 53.59,18.26 C7.1
  Top 0.254: v27.94,29.21 29.21,29.21 30.27,30.27 R23.1 | v54.69,11.43 54.61,11.51 54.61,16.51 54.06,17.06 C7.1
  Top 0.305: 26.2,42.55 Q1.3 24.3,42.38 v24.13,42.55 | S1.P$2 8.61,50.16 10.16,50.16 v10.79,49.53
  Bottom 0.254: JP5.6 33.02,6.35 29.21,10.16 23.5,10.16 22.86,10.79 22.86,12.06 23.5,12.7 27.3,12.7 27.87,13.26 | 23.5,42.55 26.57,42.55 arc-45 26.74,42.47 27.94,41.27 v27.94,29.21 27.94,13.44 arc-45 27.87,13.26 | 27.87,13.26 27.91,13.26 arc-45 28.09,13.19 28.57,12.7 30.48,12.7 34.22,8.96 arc45 34.4,8.89 52.07,8.89 53.27,10.09 arc-45 53.45,10.16 53.98,10.16 54.54,10.72 arc45 54.69,11 v54.69,11.43 | 20.32,44.45 19.68,45.09 19.68,45.72 16.71,48.69 11.61,48.69 10.79,49.51 v10.79,49.53
  Bottom 0.305: 20.32,44.45 22.23,42.55 23.5,42.55 v24.13,42.55
RTS  (via drill 0.3)
  Top 0.254: Q1.2 26.04,39.33 v26.04,39.12 | v19.05,39.37 17.78,40.64 17.78,43.38 17.6,43.56 16.38,43.56 16.03,43.2 16.03,42.01 15.74,41.72 IC2.24
  Top 0.305: Q2.1 Q1.2
  Bottom 0.254: v26.04,39.12 25.78,39.37 v19.05,39.37
SD_CLK  (via drill 0.5)
  Top 0.203: U1.21 46.1,23.25 45.72,22.86 U2.6 38.41,22.86 37.47,23.8 37.47,24.33 37.03,24.77 31.11,24.77 v30.48,24.13
  Bottom 0.254: v30.48,24.13 31.11,24.77 31.11,45.09 30.48,45.72 30.48,48.9 28.96,50.42 JP3.6
SD_CMD  (via drill 0.5)
  Top 0.203: U1.20 45.59,23.75 45.34,23.5 38.73,23.5 38.1,24.13 38.1,24.77 37.47,25.4 U2.1 v29.84,25.4
  Top 0.254: v40.64,7.62 38.1,10.16 v34.92,10.16
  Bottom 0.254: JP4.2 60.96,3.81 60.33,4.45 53.34,4.45 52.7,5.08 46.99,5.08 44.45,7.62 v40.64,7.62 | v34.92,10.16 31.11,13.97 29.84,13.97 29.21,14.61 29.21,24.77 v29.84,25.4
SD_D0  (via drill 0.5)
  Top 0.203: U1.22 46.57,22.75 46.05,22.23 38.08,22.23 36.83,23.47 36.83,23.77 36.47,24.13 U2.2 32.38,24.13 v31.75,23.5
  Bottom 0.203: 31.5,50.55 JP3.5
  Bottom 0.254: v31.75,23.5 31.75,45.72 31.5,45.97 JP3.5
SD_D1  (via drill 0.5)
  Top 0.203: v32.38,22.23 32.38,20.7 33.02,20.07 34.59,20.07 34.85,19.81 36.32,19.81 37.47,20.95 38.1,20.95 38.73,21.59 39.93,21.59 40.01,21.51 U2.5 46.35,21.59 46.61,21.84 46.61,22 46.86,22.25 U1.23
  Bottom 0.254: v32.38,22.23 32.72,22.55 32.72,24.13 32.38,24.46 32.38,45.72 32.72,46.05 32.72,48.59 34.04,49.91 JP3.4
SD_D2
  Top 0.203: U2.7 43.18,24.13 44.15,25.09 45.7,25.09 46.05,24.75 U1.18
SD_D3  (via drill 0.5)
  Top 0.203: U2.3 36.2,22.86 37.13,21.92 v37.13,21.82 | v44.48,24.28 44.56,24.25 U1.19
  Bottom 0.203: v37.13,21.82 37.47,21.59 42.55,21.59 43.18,22.23 43.18,22.99 v44.48,24.28
U0RX  (via drill 0.3, 0.5)
  Top 0.203: v34.92,17.78 35.56,18.41 37.47,18.41 38.73,19.68 41.91,19.68 42.55,20.32 48.16,20.32 48.41,20.58 U1.25
  Top 0.254: 36.83,45.72 19.99,45.72 18.67,44.4 v18.67,41.94 | 36.83,45.72 48.9,45.72 49.53,45.09 60.96,45.09 v62.23,43.81 | v36.83,45.09 36.83,45.72 | v14.58,42.49 14.74,42.33 IC2.26
  Bottom 0.254: JP2.1 63.5,45.09 v62.23,43.81 | v36.83,45.09 36.2,45.09 35.87,44.76 35.87,42.98 36.2,42.65 36.2,33.02 35.56,32.38 35.56,22.86 34.29,21.59 34.29,20.32 35.56,19.05 35.56,18.41 v34.92,17.78 | v18.67,41.94 18.62,41.88 14.99,41.88 14.58,42.29 v14.58,42.49
U0TX  (via drill 0.5)
  Top 0.203: 48.9,21.02 U1.26 48.91,20.19 48.41,19.68 43.18,19.68 42.55,19.05 39.37,19.05 v37.47,17.14
  Top 0.254: v62.23,45.72 61.59,46.35 19.61,46.35 17.37,44.12 16.15,44.12 15.47,43.43 15.47,42.22 15.24,41.99 IC2.25 | v38.73,44.45 39.37,45.09 48.26,45.09 49.12,44.22 59.84,44.22 60.25,43.81 v60.33,43.81
  Bottom 0.254: JP2.2 61.59,50.16 61.59,48.9 62.87,47.62 62.87,46.35 v62.23,45.72 v60.33,43.81 | v38.73,44.45 38.1,43.81 38.1,42.55 36.83,41.27 36.83,32.77 36.2,32.13 36.2,20.95 36.83,20.32 36.83,17.78 v37.47,17.14
USBVCC  (via drill 0.5, 0.6)
  Top 0.254: JP1.VBUS1 4.25,39.42
  Top 0.305: IC2.8 13.34,35.2
  Top 0.406: 4.25,39.42 7.62,39.42 8.1,39.9 v8.1,40.23 | v17.78,24.77 18.54,24.01 D5.2 | C8.2 C13.2 13.32,34.38 13.34,34.92 | v12.7,34.92 13.34,34.92 | 13.34,35.2 13.34,34.92
  Bottom 0.406: v17.78,24.77 17.78,34.29 17.14,34.92 v12.7,34.92 8.89,34.92 8.1,35.71 v8.1,40.23
VIN  (via drill 0.6, 0.61)
  Top 0.406: v19.68,20.95 20.84,22.11 D5.1
  Top 0.813: IC1.3 19.68,19.53 v19.68,20.95 | D4.C 17.48,10.16 20.32,10.16 | 20.32,10.16 21.46,9.02 C10.1 23.5,10.29 23.5,10.79 v24.13,11.43 | v19.68,11.43 20.32,10.79 20.32,10.16
  Bottom 0.813: v24.13,11.43 29.84,11.43 35.56,5.71 43.81,5.71 45.72,3.81 JP5.1 | v19.68,20.95 v19.68,11.43

### Text on the board
tPlace: GND | GND | 13 | 12 | 11 | 10 | 9 | 8 | 7 | 6 | 5 | 4 | 3 | 2 | 1 | 0 | RST | SCL | SDA | x | x | SCK | x | MI | x | MO | x | x | TX | RX | [x = Restricted] | DTR | RTS | GND | RI | DCD | DSR | 3V3 | CTS | ESP | PWR | noduino.org | RST | 3V3 | 3V3 | GND | GND | VIN | A0 | NC | NC | NC | CS0 | EN
bPlace: GPIO6/SD_CLK | GPIO7/SD_D0 | GPIO8/SD_D1 | GPIO0/SPI_CS2 | GPIO5 | GPIO4 | GPIO16 | GPIO14/HSPI_CLK | GPIO12/HSPI_MISO | GPIO13/HSPI_MOSI | GPIO15/HSPI_CS/I2SO_BCK | GPIO2/U1TX/I2SO_WS | GPIO1/SPI_CS1 | GPIO3/I2SO_DATA | SPI_CS0 | CHIP_EN | TOUT | AUTHOR: JACK TAN V2.2